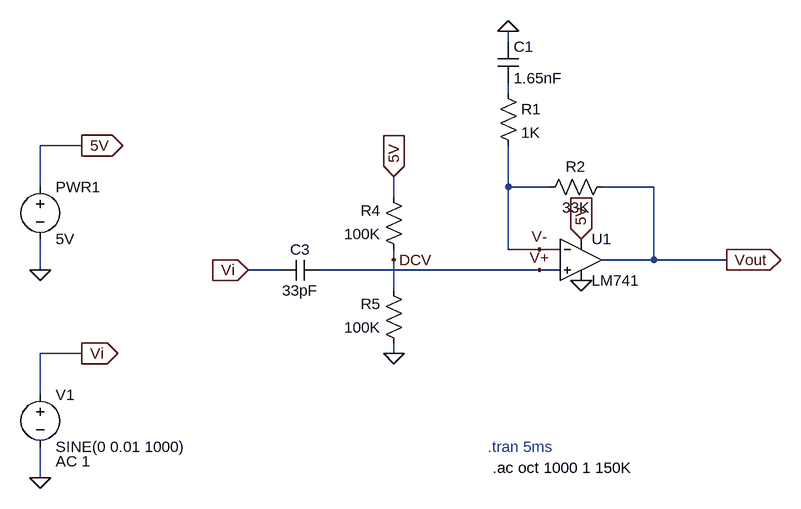
[diagram p0: schematic Draft2 copy.asc]
Draft2 copy.asc, the LTspice schematic file:
Version 4
SHEET 1 880 704
WIRE 416 16 416 0
WIRE 416 96 416 80
WIRE -240 176 -304 176
WIRE -304 240 -304 176
WIRE 416 240 416 176
WIRE 480 240 416 240
WIRE 640 240 560 240
WIRE 240 256 240 224
WIRE 416 336 416 240
WIRE 464 336 416 336
WIRE 496 336 464 336
WIRE 240 352 240 336
WIRE 640 352 640 240
WIRE 640 352 560 352
WIRE 752 352 640 352
WIRE -304 368 -304 320
WIRE 64 368 16 368
WIRE 464 368 128 368
WIRE 496 368 464 368
WIRE 240 400 240 352
WIRE -240 496 -304 496
WIRE 240 496 240 480
WIRE -304 560 -304 496
WIRE -304 688 -304 640
FLAG 528 384 0
FLAG -304 368 0
FLAG -240 176 5V
IOPIN -240 176 Out
FLAG 528 320 5V
IOPIN 528 320 In
FLAG 416 0 0
FLAG 240 496 0
FLAG 240 224 5V
IOPIN 240 224 In
FLAG -304 688 0
FLAG -240 496 Vi
IOPIN -240 496 Out
FLAG 16 368 Vi
IOPIN 16 368 In
FLAG 752 352 Vout
IOPIN 752 352 Out
FLAG 240 352 DCV
FLAG 464 368 V+
FLAG 464 336 V-
SYMBOL Voltage -304 224 R0
SYMATTR InstName PWR1
SYMATTR Value 5V
SYMBOL Res 400 80 R0
SYMATTR InstName R1
SYMATTR Value 1K
SYMBOL Res 576 224 R90
WINDOW 0 0 56 VBottom 2
WINDOW 3 32 56 VTop 2
SYMATTR InstName R2
SYMATTR Value 33K
SYMBOL Res 256 352 R180
WINDOW 0 36 76 Left 2
WINDOW 3 36 40 Left 2
SYMATTR InstName R4
SYMATTR Value 100K
SYMBOL Res 256 496 R180
WINDOW 0 36 76 Left 2
WINDOW 3 36 40 Left 2
SYMATTR InstName R5
SYMATTR Value 100K
SYMBOL Voltage -304 544 R0
WINDOW 123 24 118 Left 2
SYMATTR InstName V1
SYMATTR Value SINE(0 0.01 1000)
SYMATTR Value2 AC 1
SYMBOL Cap 400 16 R0
SYMATTR InstName C1
SYMATTR Value 1.65nF
SYMBOL Cap 128 352 R90
WINDOW 0 0 32 VBottom 2
WINDOW 3 32 32 VTop 2
SYMATTR InstName C3
SYMATTR Value 33pF
SYMBOL OpAmps/LM741 528 288 R0
SYMATTR InstName U1
TEXT 384 640 Left 2 ;.tran 5ms
TEXT 392 672 Left 2 !.ac oct 1000 1 150K

The netlist it stands for:
* Draft2 copy.asc
V§PWR1 5V 0 5V
R1 N001 V- 1K
R2 Vout V- 33K
R4 DCV 5V 100K
R5 0 DCV 100K
V1 Vi 0 SINE(0 0.01 1000) AC 1
C1 0 N001 1.65nF
C3 V+ Vi 33pF
XU1 V+ V- 5V 0 Vout LM741  ; pins In+ In- V+ V- OUT
* .tran 5ms
.ac oct 1000 1 150K
.lib LM741.lib
.backanno
.end